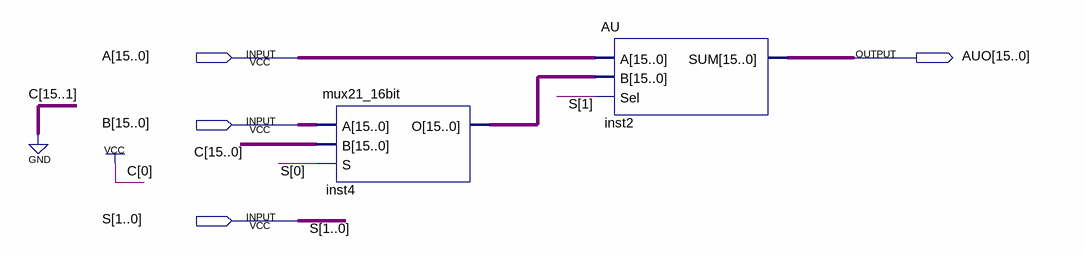
[diagram p0: schematic sheet]
// Quartus schematic ADD_SUB_1Block.bdf as structural Verilog: 2 symbols, 4 pins
module ADD_SUB_1Block (
  input  [15:0] A,
  input  [15:0] B,
  input  [1:0] S,
  output [15:0] AUO
);

  wire [15:0] inst4_o;

  mux21_16bit inst4 (.A(B), .B(16'b0000000000000001), .S(S[0]), .O(inst4_o));
  AU inst2 (.A(A), .B(inst4_o), .Sel(S[1]), .SUM(AUO));
endmodule
